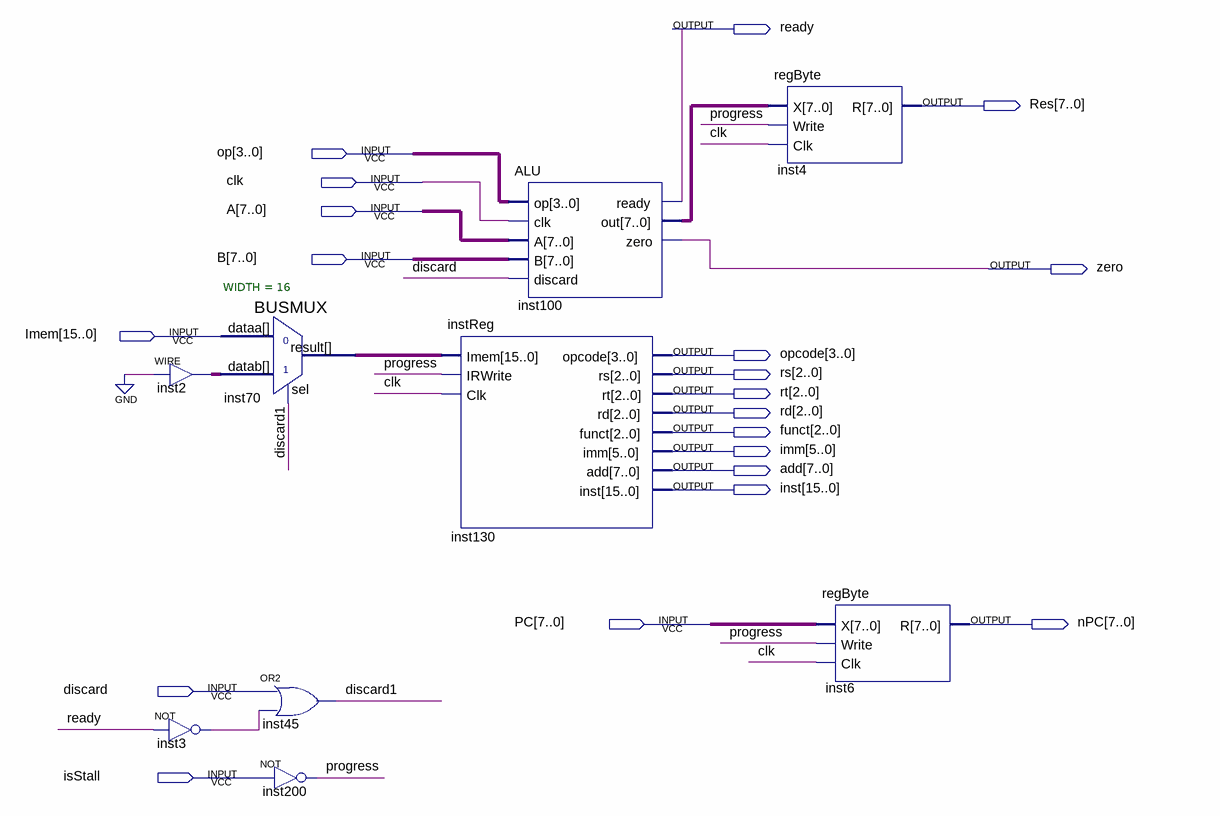
[diagram p0: schematic sheet]
// Quartus schematic ALUCycle.bdf as structural Verilog: 9 symbols, 20 pins
module ALUCycle (
  input  [3:0] op,
  input  clk,
  input  [7:0] A,
  input  [7:0] B,
  input  [15:0] Imem,
  input  [7:0] PC,
  input  discard,
  input  isStall,
  output ready,
  output [7:0] Res,
  output zero,
  output [3:0] opcode,
  output [2:0] rs,
  output [2:0] rt,
  output [2:0] rd,
  output [2:0] funct,
  output [5:0] imm,
  output [7:0] add,
  output [15:0] inst,
  output [7:0] nPC
);

  wire discard1, inst3_out, progress;
  wire [7:0] inst100_out;
  wire [15:0] inst2_out, inst70_result;

  assign inst2_out = {16{1'b0}};  // WIRE inst2
  not inst3 (inst3_out, ready);
  BUSMUX #(.WIDTH(16)) inst70 (.datab(inst2_out), .sel(discard1), .dataa(Imem), .result(inst70_result));
  or inst45 (discard1, discard, inst3_out);
  not inst200 (progress, isStall);
  instReg inst130 (
    .Imem(inst70_result), .IRWrite(progress), .Clk(clk), .opcode(opcode), .rs(rs), .rt(rt), .rd(rd),
    .funct(funct), .imm(imm), .add(add), .inst(inst));
  ALU inst100 (.op(op), .clk(clk), .A(A), .B(B), .discard(discard), .ready(ready), .out(inst100_out), .zero(zero));
  regByte inst4 (.X(inst100_out), .Write(progress), .Clk(clk), .R(Res));
  regByte inst6 (.X(PC), .Write(progress), .Clk(clk), .R(nPC));
endmodule
